# Altium schematic sheet Battery_Socket.SchDoc: Battery Socket
size A4
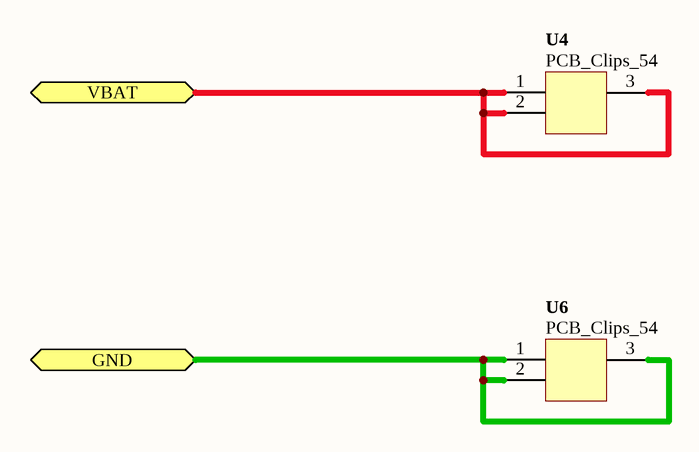
[diagram p0: Battery_Socket.SchDoc]

## Parts
U4  PCB_Clips_54  [KEYSTONE-CLIPS_54-3_V]
U6  PCB_Clips_54  [KEYSTONE-CLIPS_54-3_V]

## Ports
GND, VBAT

## Nets
GND: U6.1 U6.2 U6.3 ; port GND
VBAT: U4.1 U4.2 U4.3 ; port VBAT

## Notes on the sheet
- Sheet Title
- Project Title
- Size:
- Date:
- A4
- Item:
- Time:
- Revision:
- Sheet
- of
- File:

## Library data of the parts
U4 U6 = CMP-0466-00001-1: PC Battery Clip, Catalog No.54, Spring Steel, Body 18.102 x 13.004 mm, THM; Manufacturer: Keystone; Cell Size: 18650; # of Cells: 1; Finish/Plating: Tin-Nickel; Type: CLIP; ComponentLink2Description: Datasheet; ComponentLink2URL: http://www.keyelco.com/userAssets/file/M60-2p9.pdf; PackageReference: KEYSTONE-CLIPS_54-3; ComponentLink1URL: http://www.keyelco.com/; PackageDescription: 3-Pin Hand Drawn, Body 18.102 x 13.004 mm; Mounting Technology: Through Hole; ComponentLink1Description: Manufacturer URL; PartNumber: PCB_Clips_54; Material: Spring Steel